# EAGLE schematic pi_zero_shield_v1_KW (EAGLE 9.6.2)
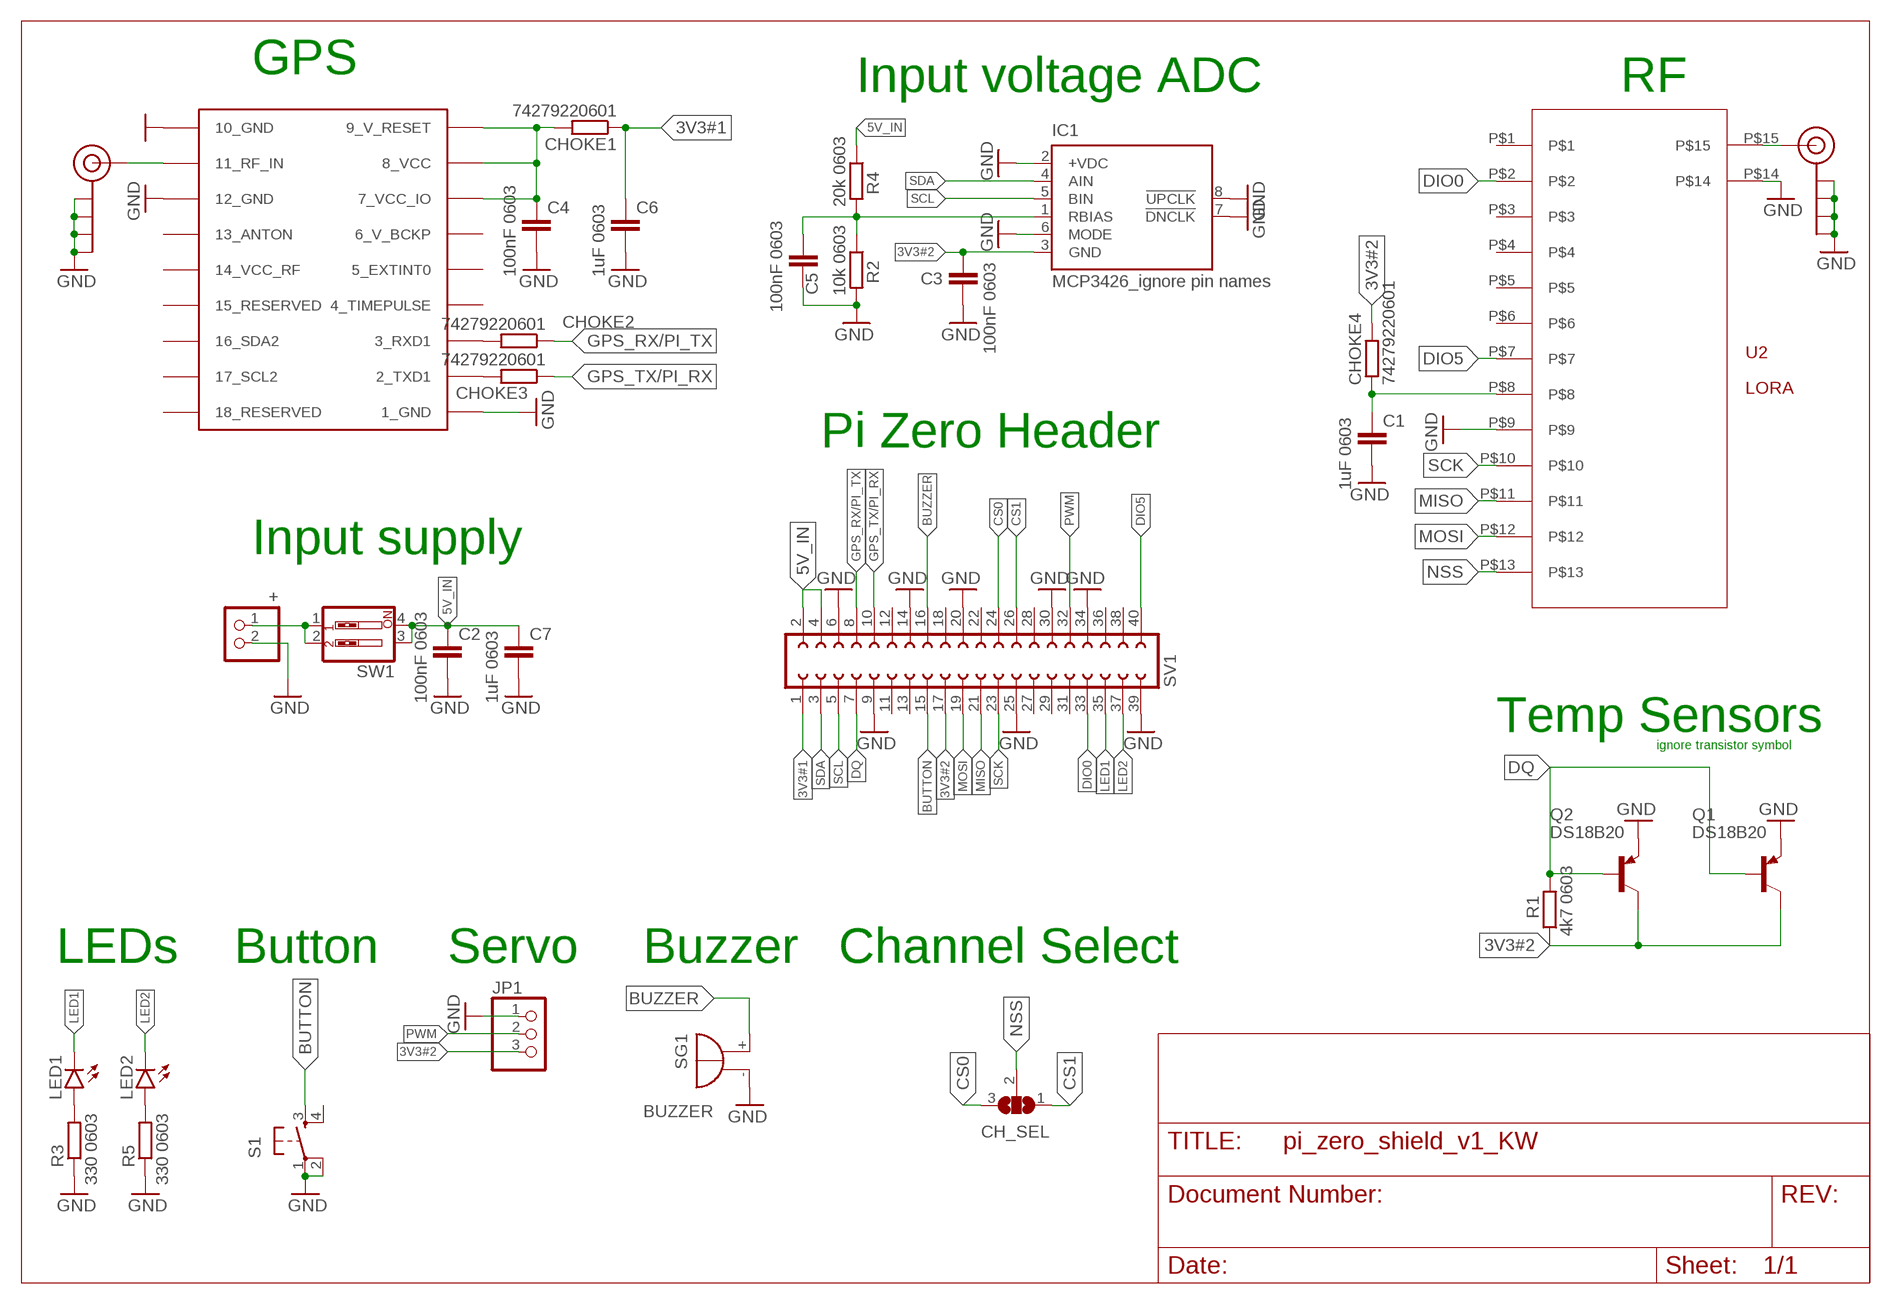
[diagram p0: schematic, sheet 1]

## Parts
+  PINHD-1X2  [1X02]
C1  1uF 0603  C-EUC0603K  [C0603K]
C2  100nF 0603  C-EUC0603K  [C0603K]
C3  100nF 0603  C-EUC0603K  [C0603K]
C4  100nF 0603  C-EUC0603K  [C0603K]
C5  100nF 0603  C-EUC0603K  [C0603K]
C6  1uF 0603  C-EUC0603K  [C0603K]
C7  1uF 0603  C-EUC0603K  [C0603K]
CH_SEL  SJ2W  [SJ_2]
CHOKE1  74279220601  R-EU_M0805  [M0805]
CHOKE2  74279220601  R-EU_M0805  [M0805]
CHOKE3  74279220601  R-EU_M0805  [M0805]
CHOKE4  74279220601  R-EU_M0805  [M0805]
IC1  MCP3426_ignore pin names  LS7183-SOIC  [SOIC08]
J$1  SMA_EDGE  [SMA-EDGE]
J$2  SMA_EDGE  [SMA-EDGE]
JP1  PINHD-1X3  [1X03]
LED1  LEDSML0603  [SML0603]
LED2  LEDSML0603  [SML0603]
Q1  DS18B20  MPSA56-TO92  [TO92-CBE]
Q2  DS18B20  MPSA56-TO92  [TO92-CBE]
R1  4k7 0603  R-EU_R0603  [R0603]
R2  10k 0603  R-EU_R0603  [R0603]
R3  330 0603  R-EU_R0603  [R0603]
R4  20k 0603  R-EU_R0603  [R0603]
R5  330 0603  R-EU_R0603  [R0603]
S1  DTS-6  [DTS-6]
SG1  BUZZER  BMT1205XH7.5  [BMT1205XH7.5]
SV1  FE20-2  [FE20-2]
SW1  SW_DIP-2  [EDG-02]
U1  U1  UBLOX_MAX-6  [UBLOX_MAX-6]
U2  LORA  [LORA_DRF]

## Nets
3V3#1: C6.1 CHOKE1.1 SV1.1
3V3#2: C3.1 CHOKE4.2 IC1.3(GND) JP1.3 Q1.C Q2.C R1.1 SV1.17
5V_IN: C2.1 C7.1 R4.1 SV1.2 SV1.4 SW1.3 SW1.4
BUTTON: S1.3 SV1.15
BUZZER: SG1.+ SV1.16
CS0: CH_SEL.3 SV1.24
CS1: CH_SEL.1 SV1.26
DIO0: SV1.33 U2.P$2
DIO5: SV1.40 U2.P$7
DQ: Q1.B Q2.B R1.2 SV1.7
DRF_VCC: C1.1 CHOKE4.1 U2.P$8
GND: +.2 C1.2 C2.2 C3.2 C4.2 C5.2 C6.2 C7.2 IC1.2(+VDC) IC1.6(MODE) IC1.7(!DNCLK) IC1.8(!UPCLK) J$1.GND@0(GND) J$1.GND@1(GND) J$1.GND@2(GND) J$1.GND@3(GND) J$2.GND@0(GND) J$2.GND@1(GND) J$2.GND@2(GND) J$2.GND@3(GND) JP1.1 Q1.E Q2.E R2.2 R3.1 R5.1 S1.1 S1.2 SG1.- SV1.6 SV1.9 SV1.14 SV1.20 SV1.25 SV1.30 SV1.34 SV1.39 U1.1_GND U1.10_GND U1.12_GND U2.P$9 U2.P$14
GPS_RX/PI_TX: CHOKE2.1 SV1.8
GPS_TX/PI_RX: CHOKE3.1 SV1.10
LED1: LED1.C SV1.35
LED2: LED2.C SV1.37
MISO: SV1.21 U2.P$11
MOSI: SV1.19 U2.P$12
N$1: +.1 SW1.1 SW1.2
N$2: J$2.SIG(SIGNAL) U2.P$15
N$3: LED1.A R3.2
N$7: CHOKE2.2 U1.3_RXD1
N$8: LED2.A R5.2
N$9: CHOKE3.2 U1.2_TXD1
N$10: C4.1 CHOKE1.2 U1.7_VCC_IO U1.8_VCC U1.9_V_RESET
N$14: J$1.SIG(SIGNAL) U1.11_RF_IN
N$15: C5.1 IC1.1(RBIAS) R2.1 R4.2
NSS: CH_SEL.2 U2.P$13
PWM: JP1.2 SV1.32
SCK: SV1.23 U2.P$10
SCL: IC1.5(BIN) SV1.5
SDA: IC1.4(AIN) SV1.3
Unconnected: S1.4 SV1.11 SV1.12 SV1.13 SV1.18 SV1.22 SV1.27 SV1.28 SV1.29 SV1.31 SV1.36 SV1.38 U1.4_TIMEPULSE U1.5_EXTINT0 U1.6_V_BCKP U1.13_ANTON U1.14_VCC_RF U1.15_RESERVED U1.16_SDA2 U1.17_SCL2 U1.18_RESERVED U2.P$1 U2.P$3 U2.P$4 U2.P$5 U2.P$6

## Notes on the sheet
- GPS
- Input voltage ADC | RF
- Pi Zero Header
- Input supply
- Temp Sensors
- ignore transistor symbol
- LEDs | Button | Servo | Buzzer | Channel Select

## Library data of the parts
+ = pinhead:PINHD-1X2: PIN HEADER
C1-C7 = rcl:C-EU: CAPACITOR, European symbol; SPICEPREFIX: C
CH_SEL = jumper:SJ2W: SMD solder JUMPER
CHOKE1-CHOKE4 R1-R5 = rcl:R-EU_: RESISTOR, European symbol; SPICEPREFIX: R
IC1 = optocoupler:LS7183: Encoder to Counter Interface Source: http://www.usdigital.com/products/ls7183-ls7184/ls7183 ls7184 Data Sheet.pdf; OC_FARNELL: unknown; OC_NEWARK: unknown
J$1 J$2 = SparkFun:SMA_EDGE: SMA Antenna Connector End launch SMA connector. The paste layer has been removed so that the connector can be hand soldered onto the board after reflow.
JP1 = pinhead:PINHD-1X3: PIN HEADER
LED1 LED2 = led:LED: LED OSRAM: - CHIPLED LG R971, LG N971, LY N971, LG Q971, LY Q971, LO R971, LY R971 LH N974, LH R974 LS Q976, LO Q976, LY Q976 LO Q996 - Hyper CHIPLED LW Q18S LB Q993, LB Q99A, LB R99A - SideLED LS A670, LO A670, LY A670, LG A670, LP A670 LB A673, LV A673, LT A673, LW A673 LH A674 LY A675 LS A676, LA A676, LO A676, LY A676, LW A676 LS A679, LY A679, LG A679 - Hyper Micro SIDELED® LS Y876, LA Y876, LO Y876, LY Y876 LT Y87S - SmartLED LW L88C, LW L88S LB L89C, LB L89S, LG L890 LS L89K, LO L89K, LY L89K LS L896, LA L896, LO L896, LY L896 - TOPLED LS T670, LO T670, LY T670, LG T670, LP T670 LSG T670, LSP T670, LSY T670, LOP T670, LYG T670 LG T671, LOG T671, LSG T671 LB T673, LV T673, LT T673, LW T673 LH T674 LS T676, LA T676, LO T676, LY T676, LB T676, LH T676, LSB T676, LW T676 LB T67C, LV T67C, LT T67C, LS T67K, LO T67K, LY T67K, LW E67C LS E67B, LA E67B, LO E67B, LY E67B, LB E67C, LV E67C, LT E67C LW T67C LS T679, LY T679, LG T679 LS T770, LO T770, LY T770, LG T770, LP T770 LB T773, LV T773, LT T773, LW T773 LH T774 LS E675, LA E675, LY E675, LS T675 LS T776, LA T776, LO T776, LY T776, LB T776 LHGB T686 LT T68C, LB T68C - Hyper Mini TOPLED® LB M676 - Mini TOPLED Santana® LG M470 LS M47K, LO M47K, LY M47K Source: http://www.osram.convergy.de LUXEON: - LUMILED® LXK2-PW12-R00, LXK2-PW12-S00, LXK2-PW14-U00, LXK2-PW14-V00 LXK2-PM12-R00, LXK2-PM12-S00, LXK2-PM14-U00 LXK2-PE12-Q00, LXK2-PE12-R00, LXK2-PE12-S00, LXK2-PE14-T00, LXK2-PE14-U00 LXK2-PB12-K00, LXK2-PB12-L00, LXK2-PB12-M00, LXK2-PB14-N00, LXK2-PB14-P00, LXK2-PB14-Q00 LXK2-PR12-L00, LXK2-PR12-M00, LXK2-PR14-Q00, LXK2-PR14-R00 LXK2-PD12-Q00, LXK2-PD12-R00, LXK2-PD12-S00 LXK2-PH12-R00, LXK2-PH12-S00 LXK2-PL12-P00, LXK2-PL12-Q00, LXK2-PL12-R00 Source: www.luxeon.com KINGBRIGHT: KA-3528ASYC Source: www.kingbright.com
Q1 Q2 = transistor-pnp:*-?: PNP Transistor
S1 = switch-tact:DTS-6
SG1 = buzzer:BMT1205XH7.5: MAGNETIC TRANSDUCER Source: Http:www.be-star.com; OC_FARNELL: unknown; OC_NEWARK: unknown
SV1 = con-lsta_new:FE20-2: FEMALE HEADER; OC_FARNELL: unknown; OC_NEWARK: unknown
SW1 = special:SW_DIP-2: DIP SWITCH
U1 = ava:UBLOX_MAX-6: UBLOX MAX-6
U2 = lora:LORA

## Net classes
0 default: width 0.152 mm, drill 0.305 mm, clearance 0.152 mm
1 vcc: width 0.152 mm, clearance 0.152 mm